# EAGLE design pixelAdapter_f070f6 (EAGLE 9.2.2)
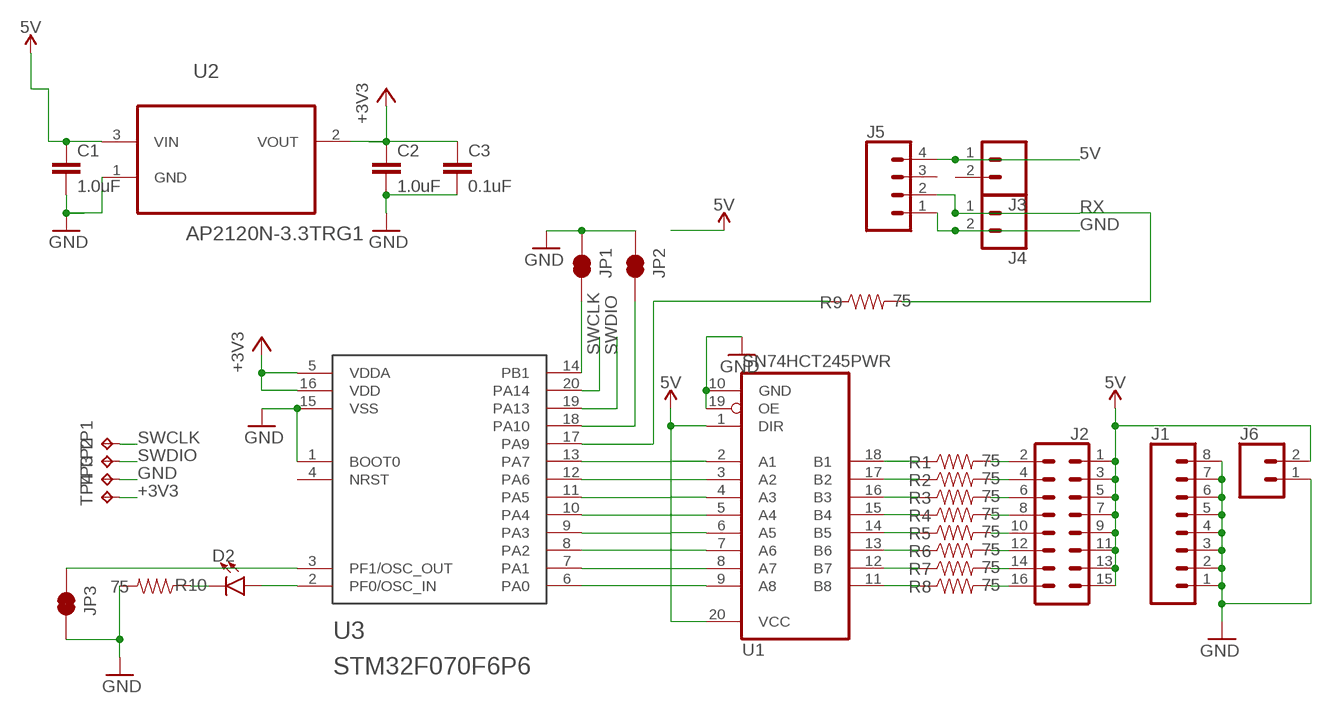
[diagram p0: schematic, sheet 1]

## Parts
C1  1.0uF  1.0UF-0603-16V-10%  [0603]
C2  1.0uF  1.0UF-0603-16V-10%  [0603]
C3  0.1uF  0.1UF-0603-25V-(+80/-20%)  [0603]
D2  LED0603  [LED-0603]
J1  CONN_08"  [1X08]
J2  CONN_08X2  [2X8]
J3  CONN_025MM  [SCREWTERMINAL-5MM-2]
J4  CONN_025MM  [SCREWTERMINAL-5MM-2]
J5  CONN_04LOCK  [1X04_LOCK]
J6  CONN_02  [1X02]
JP1  JUMPER-SMT_2_NC_TRACE_SILK  [SMT-JUMPER_2_NC_TRACE_SILK]
JP2  JUMPER-SMT_2_NC_TRACE_SILK  [SMT-JUMPER_2_NC_TRACE_SILK]
JP3  JUMPER-SMT_2_NC_TRACE_SILK  [SMT-JUMPER_2_NC_TRACE_SILK]
R1  75  100OHM-0603-1/4W-5%  [0603]
R2  75  100OHM-0603-1/4W-5%  [0603]
R3  75  100OHM-0603-1/4W-5%  [0603]
R4  75  100OHM-0603-1/4W-5%  [0603]
R5  75  100OHM-0603-1/4W-5%  [0603]
R6  75  100OHM-0603-1/4W-5%  [0603]
R7  75  100OHM-0603-1/4W-5%  [0603]
R8  75  100OHM-0603-1/4W-5%  [0603]
R9  75  100OHM-0603-1/4W-5%  [0603]
R10  75  100OHM-0603-1/4W-5%  [0603]
TP1  TPTP20SQ  [TP20SQ]
TP2  TPTP20SQ  [TP20SQ]
TP3  TPTP20SQ  [TP20SQ]
TP4  TPTP20SQ  [TP20SQ]
U1  SN74HCT245PWR  74245PW  [TSSOP20]
U2  AP2120N-3.3TRG1  MCP1700T-3302E/TT  [SOT95P237X112-3N]
U3  STM32F070F6P6  STM32F030XTSSOP20  [TSSOP-20]

## Nets
5V: C1.1 J2.1 J2.3 J2.5 J2.7 J2.9 J2.11 J2.13 J2.15 J3.1 J5.4 J6.2 U1.1(DIR) U1.20(VCC) U2.3(VIN)
+3V3: C2.1 C3.1 TP4.TP U2.2(VOUT) U3.5(VDDA) U3.16(VDD)
GND: C1.2 C2.2 C3.2 J1.1 J1.2 J1.3 J1.4 J1.5 J1.6 J1.7 J1.8 J4.2 J5.1 J6.1 JP1.1 JP2.1 JP3.2 R10.2 TP3.TP U1.10(GND) U1.19(OE) U2.1(GND) U3.1(BOOT0) U3.15(VSS)
LED0: J2.2 R1.2
LED1: J2.4 R2.2
LED2: J2.6 R3.2
LED3: J2.8 R4.2
LED4: J2.10 R5.2
LED5: J2.12 R6.2
LED6: J2.14 R7.2
LED7: J2.16 R8.2
N$1: U1.9(A8) U3.6(PA0)
N$2: JP1.2 U3.14(PB1)
N$3: U1.8(A7) U3.7(PA1)
N$4: U1.7(A6) U3.8(PA2)
N$5: U1.2(A1) U3.13(PA7)
N$6: U1.3(A2) U3.12(PA6)
N$7: U1.4(A3) U3.11(PA5)
N$8: U1.5(A4) U3.10(PA4)
N$9: U1.6(A5) U3.9(PA3)
N$10: JP2.2 U3.18(PA10)
N$11: JP3.1 U3.3(PF1/OSC_OUT)
N$12: R1.1 U1.18(B1)
N$13: R2.1 U1.17(B2)
N$14: R3.1 U1.16(B3)
N$15: R4.1 U1.15(B4)
N$16: R5.1 U1.14(B5)
N$17: R6.1 U1.13(B6)
N$18: R7.1 U1.12(B7)
N$19: R8.1 U1.11(B8)
N$20: R9.1 U3.17(PA9)
N$21: D2.C R10.1
N$23: D2.A U3.2(PF0/OSC_IN)
RX: J4.1 J5.2 R9.2
SWCLK: TP1.TP U3.20(PA14)
SWDIO: TP2.TP U3.19(PA13)
Unconnected: J3.2 J5.3 U3.4(NRST)

## Library data of the parts
C1 C2 = SparkFun-Capacitors:1.0UF: 1µF ceramic capacitors A capacitor is a passive two-terminal electrical component used to store electrical energy temporarily in an electric field.; PROD_ID: CAP-00868
C3 = SparkFun-Capacitors:0.1UF: 0.1µF ceramic capacitors A capacitor is a passive two-terminal electrical component used to store electrical energy temporarily in an electric field.; PROD_ID: CAP-00810
D2 = SparkFun-LED:LED: LED (Generic) Standard schematic elements and footprints for 5mm, 3mm, 1206, and 0603 sized LEDs. Generic LEDs with no color specified.
J1 = SparkFun-Connectors:CONN_08: Multi connection point. Often used as Generic Header-pin footprint for 0.1 inch spaced/style header connections On any of the 0.1 inch spaced packages, you can populate with these: Break Away Headers - Straight <https://www.sparkfun.com/products/116> (PRT-00116) Break Away Male Headers - Right Angle <https://www.sparkfun.com/products/553> (PRT-00553) Female Headers <https://www.sparkfun.com/products/115> (PRT-00115) Break Away Headers - Machine Pin <https://www.sparkfun.com/products/117> (PRT-00117) Break Away Female Headers - Swiss Machine Pin <https://www.sparkfun.com/products/743> (PRT-00743) Arduino Stackable Header - 8 Pin <https://www.sparkfun.com/products/9279> (PRT-09279) For SCREWTERMINALS and SPRING TERMINALS visit here: Screw Terimnals on SparkFun.com <https://www.sparkfun.com/search/results?term=Screw+Terminals> (5mm/3.5mm/2.54mm spacing) This device is also useful as a general connection point to wire up your design to another part of your project. Our various solder wires solder well into these plated through hole pads. Hook-Up Wire - Assortment (Stranded, 22 AWG) <https://www.sparkfun.com/products/11375> (PRT-11375) Hook-Up Wire - Assortment (Solid Core, 22 AWG) <https://www.sparkfun.com/products/11367> (PRT-11367) View the entire wire category on our website here <https://www.sparkfun.com/categories/141> Special notes: Molex polarized connector foot print use with SKU : PRT-08231 with associated crimp pins and housings. 1MM SMD Version SKU: PRT-10208 NOTES ON THE VARIANTS LOCK and LOCK_LONGPADS... This footprint was designed to help hold the alignment of a through-hole component (i.e. 6-pin header) while soldering it into place. You may notice that each hole has been shifted either up or down by 0.005 of an inch from it's more standard position (which is a perfectly straight line). This slight alteration caused the pins (the squares in the middle) to touch the edges of the holes. Because they are alternating, it causes a "brace" to hold the component in place. 0.005 has proven to be the perfect amount of "off-center" position when using our standard breakaway headers. Although looks a little odd when you look at the bare footprint, once you have a header in there, the alteration is very hard to notice. Also,if you push a header all the way into place, it is covered up entirely on the bottom side.; PROD_ID: CONN-08438
J2 = SparkFun-Connectors:CONN_08X2: Multi connection point. Often used as Generic Header-pin footprint for 0.1 inch spaced/style header connections You can populate with any combo of single row headers, but if you'd like an exact match, check this: Header - 2x8 (Male, 0.1") <https://www.sparkfun.com/products/13156> (PRT-13156) On any of the 0.1 inch spaced packages, you can populate with these: Break Away Headers - Straight <https://www.sparkfun.com/products/116> (PRT-00116) Break Away Male Headers - Right Angle <https://www.sparkfun.com/products/553> (PRT-00553) Female Headers <https://www.sparkfun.com/products/115> (PRT-00115) Break Away Headers - Machine Pin <https://www.sparkfun.com/products/117> (PRT-00117) Break Away Female Headers - Swiss Machine Pin <https://www.sparkfun.com/products/743> (PRT-00743)
J3 J4 = bens:CONN_02: Multi connection point. Often used as Generic Header-pin footprint for 0.1 inch spaced/style header connections On any of the 0.1 inch spaced packages, you can populate with these: Break Away Headers - Straight <https://www.sparkfun.com/products/116> (PRT-00116) Break Away Male Headers - Right Angle <https://www.sparkfun.com/products/553> (PRT-00553) Female Headers <https://www.sparkfun.com/products/115> (PRT-00115) Break Away Headers - Machine Pin <https://www.sparkfun.com/products/117> (PRT-00117) Break Away Female Headers - Swiss Machine Pin <https://www.sparkfun.com/products/743> (PRT-00743) For SCREWTERMINALS and SPRING TERMINALS visit here: Screw Terimnals on SparkFun.com <https://www.sparkfun.com/search/results?term=Screw+Terminals> (5mm/3.5mm/2.54mm spacing) This device is also useful as a general connection point to wire up your design to another part of your project. Our various solder wires solder well into these plated through hole pads. Hook-Up Wire - Assortment (Stranded, 22 AWG) <https://www.sparkfun.com/products/11375> (PRT-11375) Hook-Up Wire - Assortment (Solid Core, 22 AWG) <https://www.sparkfun.com/products/11367> (PRT-11367) View the entire wire category on our website here <https://www.sparkfun.com/categories/141> Special notes: Molex polarized connector foot print use with: PRT-08233 with associated crimp pins and housings. 2.54_SCREWTERM for use with PRT-10571. 3.5mm Screw Terminal footprints for PRT-08084 5mm Screw Terminal footprints for use with PRT-08432; SF_SKU: PRT-08432
J5 = SparkFun-Connectors:CONN_04: Multi connection point. Often used as Generic Header-pin footprint for 0.1 inch spaced/style header connections On any of the 0.1 inch spaced packages, you can populate with these: Break Away Headers - Straight <https://www.sparkfun.com/products/116> (PRT-00116) Break Away Male Headers - Right Angle <https://www.sparkfun.com/products/553> (PRT-00553) Female Headers <https://www.sparkfun.com/products/115> (PRT-00115) Break Away Headers - Machine Pin <https://www.sparkfun.com/products/117> (PRT-00117) Break Away Female Headers - Swiss Machine Pin <https://www.sparkfun.com/products/743> (PRT-00743) For SCREWTERMINALS and SPRING TERMINALS visit here: Screw Terimnals on SparkFun.com <https://www.sparkfun.com/search/results?term=Screw+Terminals> (5mm/3.5mm/2.54mm spacing) This device is also useful as a general connection point to wire up your design to another part of your project. Our various solder wires solder well into these plated through hole pads. Hook-Up Wire - Assortment (Stranded, 22 AWG) <https://www.sparkfun.com/products/11375> (PRT-11375) Hook-Up Wire - Assortment (Solid Core, 22 AWG) <https://www.sparkfun.com/products/11367> (PRT-11367) View the entire wire category on our website here <https://www.sparkfun.com/categories/141> Special notes: Molex polarized connector foot print use with SKU : PRT-08231 with associated crimp pins and housings. 1MM SMD Version SKU: PRT-10208; PROD_ID: CONN-09696
J6 = SparkFun-Connectors:CONN_02: Multi connection point. Often used as Generic Header-pin footprint for 0.1 inch spaced/style header connections On any of the 0.1 inch spaced packages, you can populate with these: Break Away Headers - Straight <https://www.sparkfun.com/products/116> (PRT-00116) Break Away Male Headers - Right Angle <https://www.sparkfun.com/products/553> (PRT-00553) Female Headers <https://www.sparkfun.com/products/115> (PRT-00115) Break Away Headers - Machine Pin <https://www.sparkfun.com/products/117> (PRT-00117) Break Away Female Headers - Swiss Machine Pin <https://www.sparkfun.com/products/743> (PRT-00743) For SCREWTERMINALS and SPRING TERMINALS visit here: Screw Terimnals on SparkFun.com <https://www.sparkfun.com/search/results?term=Screw+Terminals> (5mm/3.5mm/2.54mm spacing) This device is also useful as a general connection point to wire up your design to another part of your project. Our various solder wires solder well into these plated through hole pads. Hook-Up Wire - Assortment (Stranded, 22 AWG) <https://www.sparkfun.com/products/11375> (PRT-11375) Hook-Up Wire - Assortment (Solid Core, 22 AWG) <https://www.sparkfun.com/products/11367> (PRT-11367) View the entire wire category on our website here <https://www.sparkfun.com/categories/141> Special notes: Molex polarized connector foot print use with: PRT-08233 with associated crimp pins and housings. 2.54_SCREWTERM for use with PRT-10571. 3.5mm Screw Terminal footprints for PRT-08084 5mm Screw Terminal footprints for use with PRT-08432
JP1-JP3 = SparkFun-Jumpers:JUMPER-SMT_2_NC_TRACE: Normally closed trace jumper This jumper has a trace between two pads so it's normally closed (NC). Use a razor knife to open the connection. For best results follow the IPC guidelines for cutting traces: Cutout at least 0.063 mm (0.005 in). Remove all loose material to clean up the cut area. Seal the cut with an approved epoxy. Reapply solder to reclose the connection.
R1-R10 = SparkFun-Resistors:100OHM: 100Ω resistor A resistor is a passive two-terminal electrical component that implements electrical resistance as a circuit element. Resistors act to reduce current flow, and, at the same time, act to lower voltage levels within circuits. - Wikipedia; PROD_ID: RES-12438; VALUE: 100
TP1-TP4 = testpad:TP: Test pad
U1 = scanlime:74*245: Octal BUS TRANSCEIVER, 3-state
U2 = Microchip_By_element14_Batch_1:MCP1700T-3302E/TT: Low Quiescent Current LDO; MPN: MCP1700T-3302E/TT; OC_FARNELL: 1296592; OC_NEWARK: 88H9817; PACKAGE: SOT23-3; SUPPLIER: Microchip
U3 = stm32f030x:STM32F030X

## Board
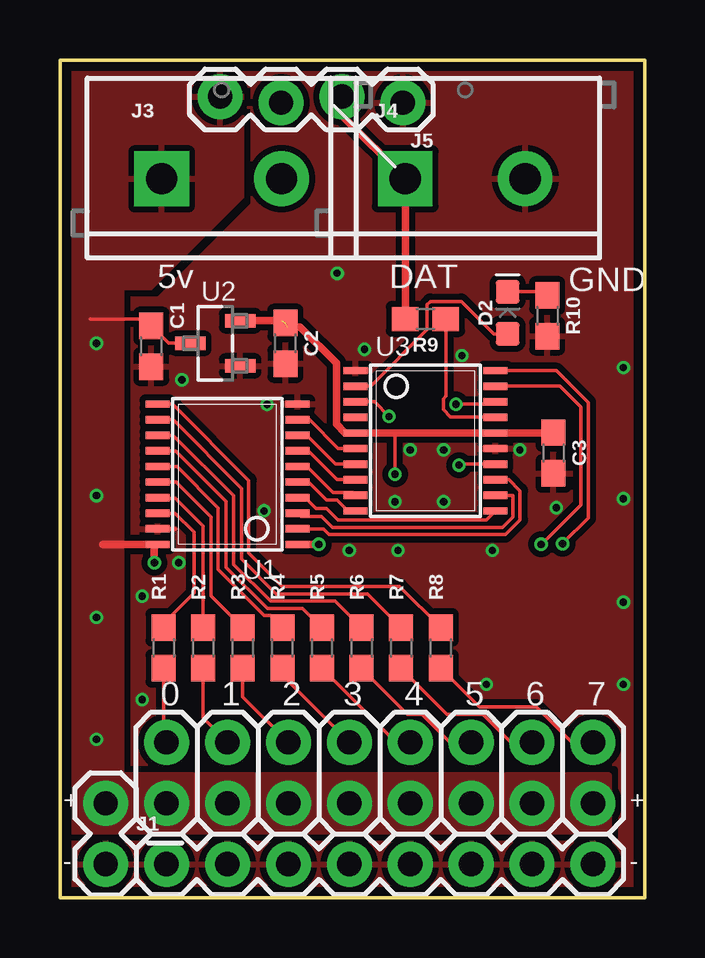
[diagram p1: board, top side]
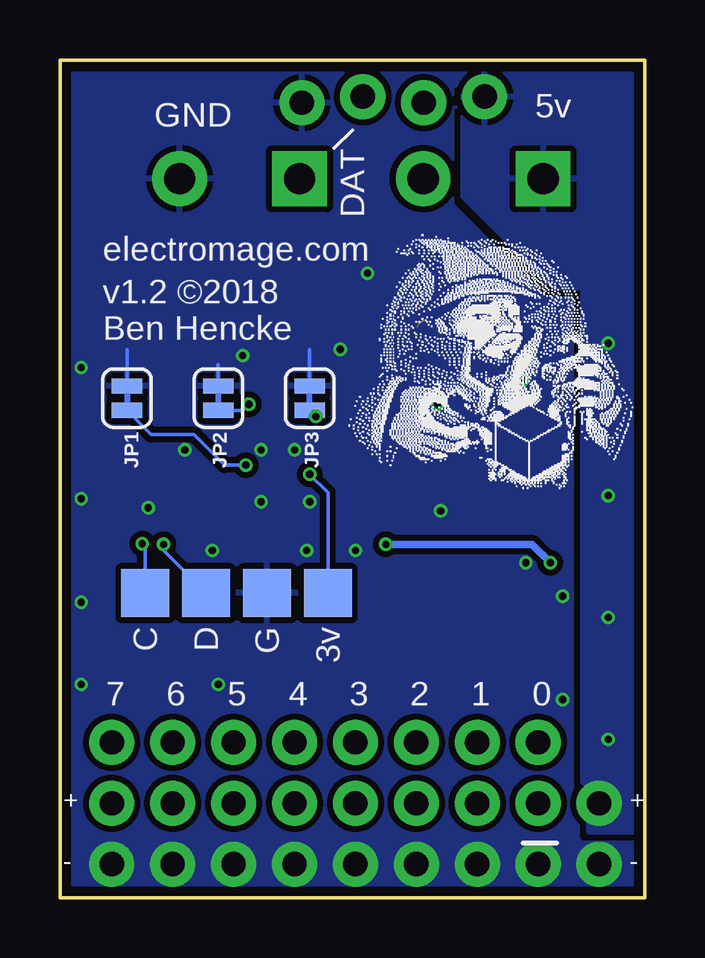
[diagram p2: board, bottom side, seen from below]

Size 24.38 x 34.92 mm. Coordinates in mm from the lower left corner, seen from the top.
Outline: 0,0 24.38,0 24.38,34.92 0,34.92 0,0
Copper layers (1*16): Top 0.035559375mm / dielectric 1.6mm / Bottom 0.035559375mm
Design rules "oshpark-2layer *": minimum track width 6mil, minimum drill 12mil, track to track 6mil, track to pad 6mil, pad to pad 6mil, via to via 6mil, smd to smd 6mil, copper to edge 15mil, drill to drill 6mil, minimum pad ring 5mil, minimum via ring 5mil, stop-mask expansion 2.5mil, vias tented up to drill 0mil, thermal gap 10mil

### Footprints (pad centres in the part's own frame; a part is rotated, then mirrored left to right if it is on the bottom)
0603 = smd 1.1 x 1: 1 -0.85,0; 2 0.85,0
LED-0603 = smd 1 x 1: A -0.877,0; C 0.877,0
1X08 = drill 1.016 pad 1.88: 1 0,0; 2 2.54,0; 3 5.08,0; 4 7.62,0; 5 10.16,0; 6 12.7,0; 7 15.24,0; 8 17.78,0
2X8 = drill 1.016 pad 1.88: 1 0,0; 2 0,2.54; 3 2.54,0; 4 2.54,2.54; 5 5.08,0; 6 5.08,2.54; 7 7.62,0; 8 7.62,2.54; 9 10.16,0; 10 10.16,2.54; 11 12.7,0; 12 12.7,2.54; 13 15.24,0; 14 15.24,2.54; 15 17.78,0; 16 17.78,2.54
SCREWTERMINAL-5MM-2 = drill 1.3 pad 2.286 square: 1 0,0 | drill 1.3 pad 2.286: 2 5,0
1X04_LOCK = drill 1.016 pad 1.88: 1 0,0.127; 2 2.54,-0.127; 3 5.08,0.127; 4 7.62,-0.127
1X02 = drill 1.016 pad 1.88: 1 0,0; 2 2.54,0
SMT-JUMPER_2_NC_TRACE_SILK = smd 0.635 x 1.27: 1 -0.508,0; 2 0.508,0
TP20SQ = smd 2 x 2: TP 0,0
TSSOP20 = smd 0.305 x 0.991: 1 -2.925,-2.918; 2 -2.275,-2.918; 3 -1.625,-2.918; 4 -0.975,-2.918; 5 -0.325,-2.918; 6 0.325,-2.918; 7 0.975,-2.918; 8 1.625,-2.918; 9 2.275,-2.918; 10 2.925,-2.918; 11 2.925,2.918; 12 2.275,2.918; 13 1.625,2.918; 14 0.975,2.918; 15 0.325,2.918; 16 -0.325,2.918; 17 -0.975,2.918; 18 -1.625,2.918; 19 -2.275,2.918; 20 -2.925,2.918
SOT95P237X112-3N = smd 0.559 x 1.27: 1 -0.94,-1.041; 2 0.94,-1.041; 3 0,1.041
TSSOP-20 = smd 0.305 x 0.991: 1 -2.925,-2.918; 2 -2.275,-2.918; 3 -1.625,-2.918; 4 -0.975,-2.918; 5 -0.325,-2.918; 6 0.325,-2.918; 7 0.975,-2.918; 8 1.625,-2.918; 9 2.275,-2.918; 10 2.925,-2.918; 11 2.925,2.918; 12 2.275,2.918; 13 1.625,2.918; 14 0.975,2.918; 15 0.325,2.918; 16 -0.325,2.918; 17 -0.975,2.918; 18 -1.625,2.918; 19 -2.275,2.918; 20 -2.925,2.918

### Placement (x,y rotation side)
C1  3.81,22.99 270 top
C2  9.4,23.11 270 top
C3  20.57,18.54 270 top
D2  18.67,24.38 90 top
J1  4.45,1.4 0 top
J2  4.45,3.94 0 top
J3  4.24,29.97 0 top
J4  14.4,29.97 0 top
J5  14.3,33.27 180 top
J6  1.91,1.4 90 top
JP1  21.59,20.83 270 bottom
JP2  17.78,20.83 270 bottom
JP3  13.97,20.83 90 bottom
R1  4.32,10.41 270 top
R2  5.97,10.41 270 top
R3  7.62,10.41 270 top
R4  9.27,10.41 270 top
R5  10.92,10.41 270 top
R6  12.57,10.41 270 top
R7  14.22,10.41 270 top
R8  15.88,10.41 270 top
R9  15.24,24.13 180 top
R10  20.32,24.26 270 top
TP1  20.83,12.7 90 bottom
TP2  18.29,12.7 90 bottom
TP3  15.75,12.7 90 bottom
TP4  13.21,12.7 90 bottom
U1  6.99,17.65 90 top
U2  6.48,23.11 90 top
U3  15.24,19.05 270 top
U$2  [EM-LOGO4]  12.7,16 0 bottom

### Tracks (layer width: path | path; a pad name or v marks a point on that pad's centre or on a via)
5V  (via drill 0.3)
  Top 0.152: 1.27,24.13 3.81,24.13 C1.1 4.53,23.11 U2.3
  Top 0.305: U1.1 v10.79,14.73 | v3.94,13.97 3.94,14.6 U1.20 1.78,14.73
  Bottom 0.305: v3.94,13.97 4.7,14.73 v10.79,14.73
  other vias: 1.52,6.6 1.52,11.68 1.52,16.76 1.52,23.11
  pour Top (isolate 0.254, no thermals): 22.86,5.08 22.86,2.79 -1.27,2.79 -1.27,25.4 2.54,25.4 2.54,5.08
  pour Top (isolate 0.254): 7.62,35.56 7.62,29.21 3.81,25.4 -1.27,25.4 -1.27,35.56
  pour Bottom (isolate 0.254): 7.62,35.56 7.62,29.21 3.81,25.4 -1.27,25.4 -1.27,35.56
  pour Bottom (isolate 0.254, no thermals): 2.54,4.83 2.29,4.57 2.29,2.79 -1.27,2.79 -1.27,25.4 2.54,25.4 2.54,5.08
+3V3  (via drill 0.3)  (2 unrouted)
  Top 0.152: v13.97,17.65 13.97,19.38
  Top 0.305: U2.2 9.23,24.05 | C3.1 20.41,19.38 U3.16 13.97,19.38 U3.5 11.89,19.38 11.52,19.75 11.52,22.29 10.01,23.8 9.48,23.8
  Bottom 0.152: TP4.TP 13.21,16.89 v13.97,17.65
GND  (via drill 0.3)
  Top 0.152: U1.19 4.82,15.38
  Top 0.305: 7.61,22.09 U2.1
  Bottom 0.152: JP1.1 21.59,22.86 | JP2.1 17.78,22.23 | JP3.2 13.97,22.86
  other vias: 23.5,8.89 17.78,8.89 23.5,12.32 23.5,22.1 23.5,16.64 14.1,14.48 12.06,14.48 11.56,26.04 5.08,21.59 12.7,22.86 19.18,18.67 18.03,14.48 4.95,13.97 3.43,12.57 8.64,20.57 8.51,16.13 16,18.67 14.61,18.67 13.97,16.51 16,16.51 20.7,16.26 16.76,22.61 3.43,8.26
  pour Top (isolate 0.254, rank 6): 0,35.56 25.4,35.56 25.4,0 0,0
  pour Bottom (isolate 0.254, rank 6): 0,35.56 25.4,35.56 25.4,0 0,0
  pour Bottom (isolate 0.254, rank 6, no thermals): -1.27,2.54 25.4,2.54 25.4,-1.27 -1.27,-1.27
LED0
  Top 0.152: R1.2 4.32,6.6 J2.2
LED1
  Top 0.152: R2.2 5.97,7.49 J2.4
LED2
  Top 0.152: R3.2 7.62,8.38 J2.6
LED3
  Top 0.152: R4.2 9.27,9.27 J2.8
LED4
  Top 0.152: R5.2 14.01,6.48 J2.10
LED5
  Top 0.152: R6.2 14.49,7.64 15.09,7.64 16.26,6.48 J2.12
LED6
  Top 0.152: R7.2 16.14,7.64 17.63,7.64 18.8,6.48 J2.14
LED7
  Top 0.152: R8.2 17.49,7.95 19.86,7.95 21.34,6.48 J2.16
N$1
  Top 0.152: U3.6 11.6,18.73 10.4,19.93 U1.9
N$2  (via drill 0.3)
  Top 0.152: U3.14 16.68,18.07 v16.64,18.03
  Bottom 0.152: v16.64,18.03 17.53,18.03 18.8,19.3 20.57,19.3 21.23,19.96 21.23,20.32 JP1.2
N$3
  Top 0.152: U1.8 10.29,19.28 11.49,18.07 U3.7
N$4
  Top 0.152: U1.7 10.36,18.63 11.56,17.43 U3.8
N$5
  Top 0.152: U1.2 10.98,15.38 11.23,15.13 18.57,15.13 19.19,15.75 19.19,16.97 18.73,17.43 U3.13
N$6
  Top 0.152: U1.3 10.05,15.88 10.91,15.88 11.36,15.44 18.44,15.44 18.88,15.88 18.88,16.77 U3.12
N$7
  Top 0.152: U1.4 10.22,16.68 10.67,16.23 11.11,16.23 11.6,15.74 17.78,15.74 U3.11
N$8
  Top 0.152: U1.5 10.36,17.33 11.11,16.57 11.55,16.57 12,16.12 U3.10
N$9
  Top 0.152: U1.6 10.29,17.98 11.38,16.89 12.21,16.89 U3.9
N$10  (via drill 0.3)
  Top 0.152: v16.51,20.57 18.06,20.57 U3.18
  Bottom 0.152: JP2.2 16.76,20.32 v16.51,20.57
N$11  (via drill 0.3)
  Top 0.152: v13.72,20.07 13.11,20.68 U3.3
  Bottom 0.152: v13.72,20.07 JP3.1
N$12
  Top 0.152: R1.1 4.32,11.43 5.59,12.7 5.59,15.24 4.8,16.03 U1.18
N$13
  Top 0.152: R2.1 5.97,15.49 4.83,16.64 4.11,16.64 U1.17
N$14
  Top 0.152: R3.1 6.3,12.59 6.3,15.88 4.85,17.33 U1.16
N$15
  Top 0.152: U1.15 4.88,17.98 6.6,16.26 6.6,13.97 6.6,13.93 6.6,13.68 6.63,13.65 8.52,11.76 8.78,11.76 R4.1
N$16
  Top 0.152: U1.14 4.82,18.63 6.93,16.51 6.93,13.78 8.65,12.06 10.12,12.06 R5.1
N$17
  Top 0.152: U1.13 4.72,19.28 7.24,16.76 7.24,13.9 8.77,12.37 11.47,12.37 R6.1
N$18
  Top 0.152: U1.12 4.71,19.93 7.57,17.07 7.57,14.12 9.02,12.68 12.81,12.68 R7.1
N$19
  Top 0.152: U1.11 4.7,20.58 7.87,17.4 7.87,14.38 9.27,12.98 14.16,12.98 R8.1
N$20
  Top 0.152: U3.17 18.14,20.04 16.29,20.04 15.98,20.35 15.98,20.79 16.09,20.9 R9.1
N$21
  Top 0.152: D2.C 20.17,25.26 R10.1
N$23
  Top 0.152: U3.2 12.34,21.34 12.97,21.34 15.31,23.68 15.31,24.73 15.45,24.86 16.73,24.86 18.09,23.51 D2.A
RX
  Top 0.305: J5.2 11.76,32.61 J4.1 R9.2
SWCLK  (via drill 0.3)
  Top 0.152: v20.95,14.76 22.02,15.83 22.02,20.65 20.7,21.97 U3.20
  Bottom 0.152: TP1.TP 20.83,14.63 v20.95,14.76
SWDIO  (via drill 0.3)
  Top 0.152: U3.19 20.84,21.32 21.72,20.45 21.72,16.38 v20.07,14.73
  Bottom 0.152: TP2.TP 20.07,14.48 v20.07,14.73

### Text on the board
tNames: 5v | DAT | GND | 0 | 1 | 2 | 3 | 4 | 5 | 6 | 7 | + | + | - | -
bNames: 5v | GND | DAT | electromage.com | v1.2 ©2018 / Ben Hencke | 3v | G | D | C | 0 | 1 | 2 | 3 | 4 | 5 | 6 | 7 | + | + | - | -